# Altium project Audio_Jammer.PrjPcb
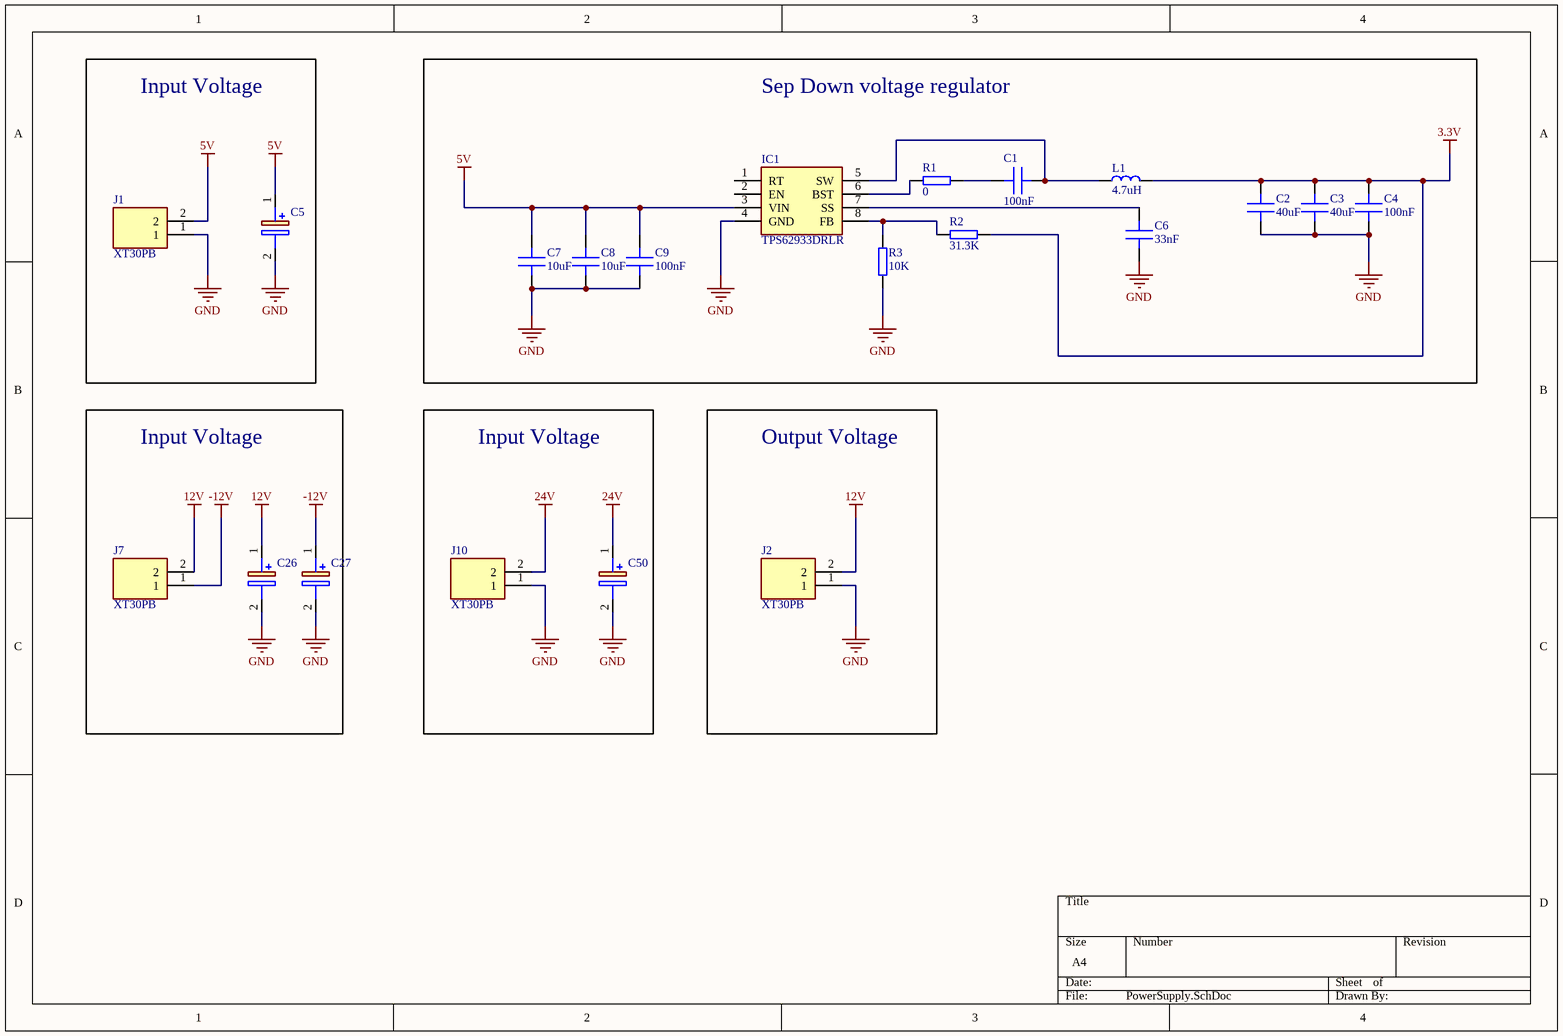
[diagram p0: PowerSupply.SchDoc]
4 sheets, 108 parts. Net scope: flat (ports and power ports of the same name join across sheets).
Board file: MainDevice.PcbDoc
Sheets:
  PowerSupply.SchDoc
  MCU.SchDoc
  Interface.SchDoc
  Amplifiers.SchDoc

## Sheet PowerSupply.SchDoc
size A4; SheetNumber: 1; SheetTotal: 4

### Parts
C1  100nF  [C 0402]
C2  40uF  [C 1206]
C3  40uF  [C 1206]
C4  100nF  [C 0603]
C5  UVY1V101MED1TD  [CAPPRD250W50D655H1250]  (value not drawn)
C6  33nF  [C 0402]
C7  10uF  [C 1206]
C8  10uF  [C 1206]
C9  100nF  [C 0603]
C26  UVY1V101MED1TD  [CAPPRD250W50D655H1250]  (value not drawn)
C27  UVY1V101MED1TD  [CAPPRD250W50D655H1250]  (value not drawn)
C50  UVY1V101MED1TD  [CAPPRD250W50D655H1250]  (value not drawn)
IC1  TPS62933DRLR  [SOTFL50P160X60-8N]
J1  XT30PB  [XT30PB]
J2  XT30PB  [XT30PB]
J7  XT30PB  [XT30PB]
J10  XT30PB  [XT30PB]
L1  4.7uH  [HPI0630]
R1  0  [R 0402]
R2  31.3K  [R 0402]
R3  10K  [R 0402]

### Blocks framed on the sheet
Input Voltage: C5 J1
Sep Down voltage regulator: C1-C4 C6-C9 IC1 L1 R1-R3
Input Voltage: C26 C27 J7
Input Voltage: C50 J10
Output Voltage: J2

### Nets
3.3V: C2.1 C3.1 C4.1 L1.2 R2.1
5V: C5.1(+) C7.1 C8.1 C9.1 IC1.3(VIN) J1.2
12V: C26.1(+) J2.2 J7.2
24V: C50.1(+) J10.2
-12V: C27.1(+) J7.1
GND: C2.2 C3.2 C4.2 C5.2(-) C6.2 C7.2 C8.2 C9.2 C26.2(-) C27.2(-) C50.2(-) IC1.4(GND) J1.1 J2.1 J10.1 R3.1
NetC1_1: C1.1 R1.1
NetC1_2: C1.2 IC1.5(SW) L1.1
NetC6_1: C6.1 IC1.7(SS)
NetIC1_6: IC1.6(BST) R1.2
NetIC1_8: IC1.8(FB) R2.2 R3.2

Not connected (* = marked no-connect by the designer): IC1 1(RT) 2(EN)

### Library data of the parts
C1-C4 C6-C9 = Capacitor: MLCC Capacitor
C5 C26 C27 C50 = UVY1V101MED1TD: Capacitor Polarised; Manufacturer_Name: Nichicon; Datasheet Link: http://nichicon-us.com/english/products/pdfs/e-uvy.pdf; Height: 12.5mm; Manufacturer_Part_Number: UVY1V101MED1TD; Arrow Part Number: UVY1V101MED1TD; Arrow Price/Stock: https://www.arrow.com/en/products/uvy1v101med1td/nichicon
IC1 = TPS62933DRLR: Integrated Circuit; Manufacturer_Name: Texas Instruments; Datasheet Link: https://www.ti.com/lit/ds/symlink/tps62933.pdf?ts=1626073394234; Height: 0.6mm; Manufacturer_Part_Number: TPS62933DRLR; Mouser Part Number: 595-TPS62933DRLR; Mouser Price/Stock: https://www.mouser.co.uk/ProductDetail/Texas-Instruments/TPS62933DRLR?qs=Rp5uXu7WBW9fv47wfQVntQ%3D%3D; Arrow Part Number: TPS62933DRLR; Arrow Price/Stock: https://www.arrow.com/en/products/tps62933drlr/texas-instruments?utm_currency=USD&region=nac
J1 J2 J7 J10 = XT30PB: Connector; Manufacturer_Name: Amass; Datasheet Link: https://www.tme.eu/Document/4acc913878197f8c2e30d4b8cdc47230/XT30UPB%20SPEC.pdf; Height: 10.7mm; Manufacturer_Part_Number: XT30PB
L1 = Inductor: General pourpouse inductor
R1-R3 = Resistor: General pourpouse resistor

## Sheet MCU.SchDoc
size A4; SheetNumber: 2; SheetTotal: 4
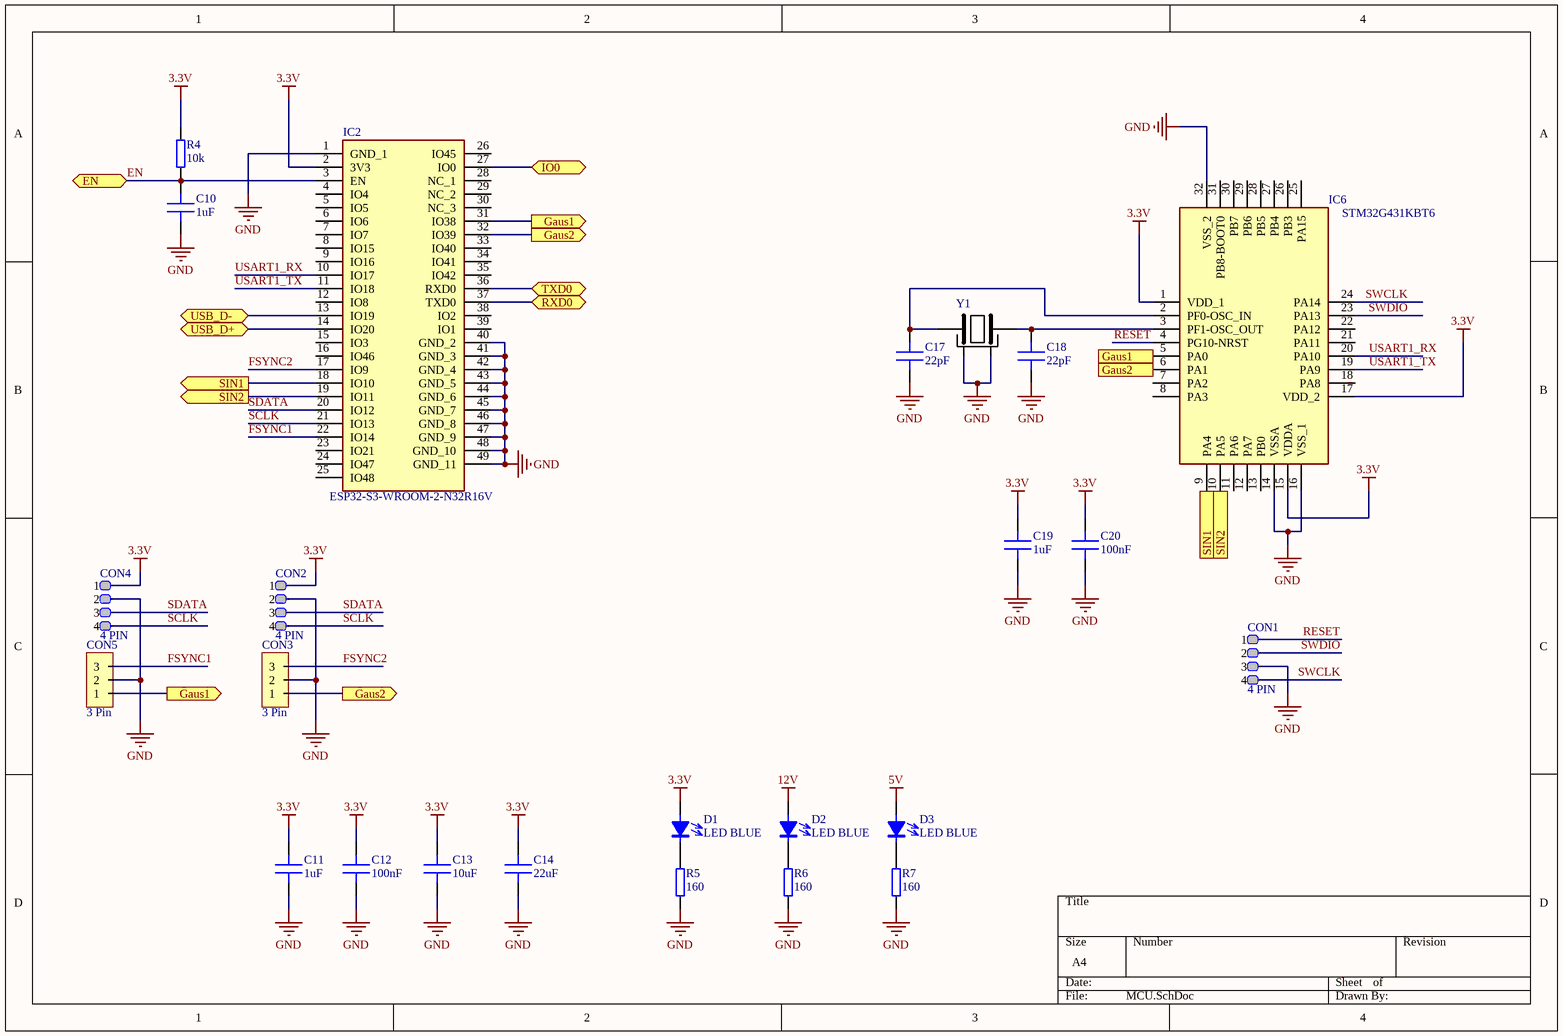
[diagram p1: MCU.SchDoc]

### Parts
C10  1uF  [C 0402]
C11  1uF  [C 0402]
C12  100nF  [C 0402]
C13  10uF  [C 0402]
C14  22uF  [C 0402]
C17  22pF  [C 0402]
C18  22pF  [C 0402]
C19  1uF  [C 0402]
C20  100nF  [C 0402]
CON1  4 PIN  [SM04B-SRSS-TB]
CON2  4 PIN  [Goldpin 2.54 4P]
CON3  3 Pin  [Goldpin 2.54 3P]
CON4  4 PIN  [Goldpin 2.54 4P]
CON5  3 Pin  [Goldpin 2.54 3P]
D1  LED BLUE  [LED 0603 BLUE]
D2  LED BLUE  [LED 0603 BLUE]
D3  LED BLUE  [LED 0603 BLUE]
IC2  ESP32-S3-WROOM-2-N32R16V  [ESP32S3WROOM2N32R16V]
IC6  STM32G431KBT6  [QFP80P900X900X160-32N]
R4  10k  [R 0402]
R5  160  [R 0402]
R6  160  [R 0402]
R7  160  [R 0402]
Y1  MCSJK-7U-16.00-12-30-80-B-30  [MCSJK7U1600123080B30]  (value not drawn)

### Ports
EN (bidir), Gaus1 (out), Gaus2 (out), IO0 (bidir), RXD0 (bidir), SIN1 (out), SIN2 (out), TXD0 (bidir), USB_D+ (bidir), USB_D- (bidir)

### Nets
3.3V: C11.1 C12.1 C13.1 C14.1 C19.1 C20.1 CON2.1 CON4.1 D1.1 IC2.2(3V3) IC6.1(VDD_1) IC6.15(VDDA) IC6.17(VDD_2) R4.2
5V: D3.1
12V: D2.1
GND: C10.2 C11.2 C12.2 C13.2 C14.2 C17.2 C18.2 C19.2 C20.2 CON1.3 CON2.2 CON3.2 CON4.2 CON5.2 IC2.1(GND_1) IC2.40(GND_2) IC2.41(GND_3) IC2.42(GND_4) IC2.43(GND_5) IC2.44(GND_6) IC2.45(GND_7) IC2.46(GND_8) IC2.47(GND_9) IC2.48(GND_10) IC2.49(GND_11) IC6.14(VSSA) IC6.16(VSS_1) IC6.32(VSS_2) R5.1 R6.1 R7.1 Y1.2(GND_1) Y1.4(GND_2)
EN: C10.1 IC2.3(EN) R4.1 ; port EN
FSYNC1: CON5.3 IC2.22(IO14)
FSYNC2: CON3.3 IC2.17(IO9)
IN1: IC2.18(IO10) IC6.9(PA4) ; port SIN1
IN2: IC2.19(IO11) IC6.10(PA5) ; port SIN2
IO0: IC2.27(IO0) ; port IO0
RESET: CON1.1 IC6.4(PG10-NRST)
RXD0: IC2.37(TXD0) ; port RXD0
SCLK: CON2.4 CON4.4 IC2.21(IO13)
SDATA: CON2.3 CON4.3 IC2.20(IO12)
SWCLK: CON1.4 IC6.24(PA14)
SWDIO: CON1.2 IC6.23(PA13)
TXD0: IC2.36(RXD0) ; port TXD0
USART1_RX: IC2.10(IO17) IC6.20(PA10)
USART1_TX: IC2.11(IO18) IC6.19(PA9)
NetC17_1: C17.1 IC6.2(PF0-OSC_IN) Y1.1(CRYSTAL_1)
NetC18_1: C18.1 IC6.3(PF1-OSC_OUT) Y1.3(CRYSTAL_2)
NetCON3_1: CON3.1 IC2.32(IO39) IC6.6(PA1) ; port Gaus2
NetCON5_1: CON5.1 IC2.31(IO38) IC6.5(PA0) ; port Gaus1
NetD1_2: D1.2 R5.2
NetD2_2: D2.2 R6.2
NetD3_2: D3.2 R7.2
NetD4_2: IC2.13(IO19) ; port USB_D-
NetD5_2: IC2.14(IO20) ; port USB_D+

Not connected (* = marked no-connect by the designer): IC2 4(IO4) 5(IO5) 6(IO6) 7(IO7) 8(IO15) 9(IO16) 12(IO8) 15(IO3) 16(IO46) 23(IO21) 24(IO47) 25(IO48) 26(IO45) 28(NC_1) 29(NC_2) 30(NC_3) 33(IO40) 34(IO41) 35(IO42) 38(IO2) 39(IO1); IC6 7(PA2) 8(PA3) 11(PA6) 12(PA7) 13(PB0) 18(PA8) 21(PA11) 22(PA12) 25(PA15) 26(PB3) 27(PB4) 28(PB5) 29(PB6) 30(PB7) 31(PB8-BOOT0)

### Library data of the parts
C10-C14 C17-C20 = Capacitor: MLCC Capacitor
IC2 = ESP32-S3-WROOM-2-N32R16V: Integrated Circuit; Manufacturer_Name: Espressif Systems; Datasheet Link: https://www.digikey.in/en/products/detail/espressif-systems/ESP32-S3-WROOM-2-N32R16V/25811280; Height: 3.25mm; Manufacturer_Part_Number: ESP32-S3-WROOM-2-N32R16V; Mouser Part Number: 356-SP32S3WM2N32R16V; Mouser Price/Stock: https://www.mouser.co.uk/ProductDetail/Espressif-Systems/ESP32-S3-WROOM-2-N32R16V?qs=%252BHhoWzUJg4Kf%2FwmS40wg%252BQ%3D%3D
IC6 = STM32G431KBT6: Integrated Circuit; Manufacturer_Name: STMicroelectronics; Datasheet Link: https://www.st.com/resource/en/datasheet/stm32g431kb.pdf; Height: 1.6mm; Manufacturer_Part_Number: STM32G431KBT6; Mouser Part Number: 511-STM32G431KBT6; Mouser Price/Stock: https://www.mouser.co.uk/ProductDetail/STMicroelectronics/STM32G431KBT6?qs=T3oQrply3y8teCTeNAFOLg%3D%3D; Arrow Part Number: STM32G431KBT6; Arrow Price/Stock: https://www.arrow.com/en/products/stm32g431kbt6/stmicroelectronics
R4-R7 = Resistor: General pourpouse resistor
Y1 = MCSJK-7U-16.00-12-30-80-B-30: Crystal or Oscillator; Manufacturer_Name: MULTICOMP; Datasheet Link: https://www.farnell.com/datasheets/2864166.pdf; Height: 0.8mm; Manufacturer_Part_Number: MCSJK-7U-16.00-12-30-80-B-30

## Sheet Interface.SchDoc
size A4; SheetNumber: 3; SheetTotal: 4
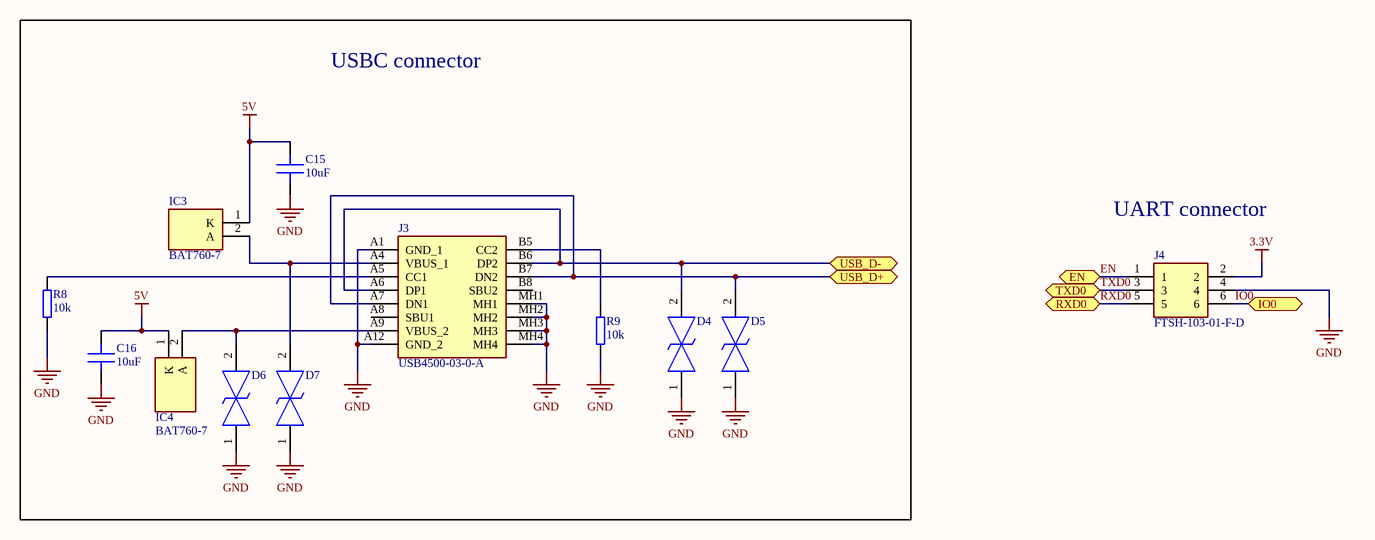
[diagram p2: Interface.SchDoc]

### Parts
C15  10uF  [C 0402]
C16  10uF  [C 0402]
D4  LESD5D5.0CT1G  [LESD5D50CT1G]  (value not drawn)
D5  LESD5D5.0CT1G  [LESD5D50CT1G]  (value not drawn)
D6  LESD5D5.0CT1G  [LESD5D50CT1G]  (value not drawn)
D7  LESD5D5.0CT1G  [LESD5D50CT1G]  (value not drawn)
IC3  BAT760-7  [SOD2513X120N]
IC4  BAT760-7  [SOD2513X120N]
J3  USB4500-03-0-A  [USB4500030A]
J4  FTSH-103-01-F-D  [FTSH-103-XX-YYY-D]
R8  10k  [R 0402]
R9  10k  [R 0402]

### Blocks framed on the sheet
USBC connector: C15 C16 D4-D7 IC3 IC4 J3 R8 R9

### Ports
EN (bidir), IO0 (bidir), RXD0 (bidir), TXD0 (bidir), USB_D+ (bidir), USB_D- (bidir)

### Nets
3.3V: J4.2
5V: C15.1 C16.1 IC3.1(K) IC4.1(K)
GND: C15.2 C16.2 D4.1 D5.1 D6.1 D7.1 J3.A1(GND_1) J3.A12(GND_2) J3.MH1 J3.MH2 J3.MH3 J3.MH4 J4.4 R8.1 R9.1
EN: J4.1 ; port EN
IO0: J4.6 ; port IO0
RXD0: J4.5 ; port RXD0
TXD0: J4.3 ; port TXD0
NetD4_2: D4.2 J3.A6(DP1) J3.B6(DP2) ; port USB_D-
NetD5_2: D5.2 J3.A7(DN1) J3.B7(DN2) ; port USB_D+
NetD6_2: D6.2 IC4.2(A) J3.A9(VBUS_2)
NetD7_2: D7.2 IC3.2(A) J3.A4(VBUS_1)
NetJ3_A5: J3.A5(CC1) R8.2
NetJ3_B5: J3.B5(CC2) R9.2

Not connected (* = marked no-connect by the designer): J3 A8(SBU1) B8(SBU2)

### Notes on the sheet
- UART connector

### Library data of the parts
C15 C16 = Capacitor: MLCC Capacitor
D4-D7 = LESD5D5.0CT1G: TVS Diode (Bi-directional); Manufacturer_Name: LRC; Height: 0.7mm; Manufacturer_Part_Number: LESD5D5.0CT1G
IC3 IC4 = BAT760-7: Integrated Circuit; Manufacturer_Name: Lattice Semiconductor; Datasheet Link: https://www.diodes.com/assets/Datasheets/ds30498.pdf; Height: 1.2mm; Manufacturer_Part_Number: BAT760-7; Mouser Part Number: N/A; Mouser Price/Stock: https://www.mouser.com/Search/Refine.aspx?Keyword=N%2FA
J3 = USB4500-03-0-A: Connector; Manufacturer_Name: GCT (GLOBAL CONNECTOR TECHNOLOGY); Datasheet Link: https://componentsearchengine.com/Datasheets/2/USB4500-03-0-A.pdf; Manufacturer_Part_Number: USB4500-03-0-A; Mouser Part Number: 640-USB4500030A; Mouser Price/Stock: https://www.mouser.co.uk/ProductDetail/GCT/USB4500-03-0-A?qs=7D1LtPJG0i2mVyw7UtV%2FkQ%3D%3D
J4 = FTSH-103-01-F-D: Connector; Manufacturer_Name: SAMTEC; Datasheet Link: http://suddendocs.samtec.com/prints/ftsh-1xx-xx-xxx-d-xxx-xx-mkt.pdf; Manufacturer_Part_Number: FTSH-103-01-F-D; Mouser Part Number: 200-FTSH10301FD; Mouser Price/Stock: https://www.mouser.co.uk/ProductDetail/Samtec/FTSH-103-01-F-D?qs=0lQeLiL1qyb7OHmlWV4egA%3D%3D; Arrow Part Number: FTSH-103-01-F-D; Arrow Price/Stock: https://www.arrow.com/en/products/ftsh-103-01-f-d/samtec
R8 R9 = Resistor: General pourpouse resistor

## Sheet Amplifiers.SchDoc
size A4; SheetNumber: 4; SheetTotal: 4
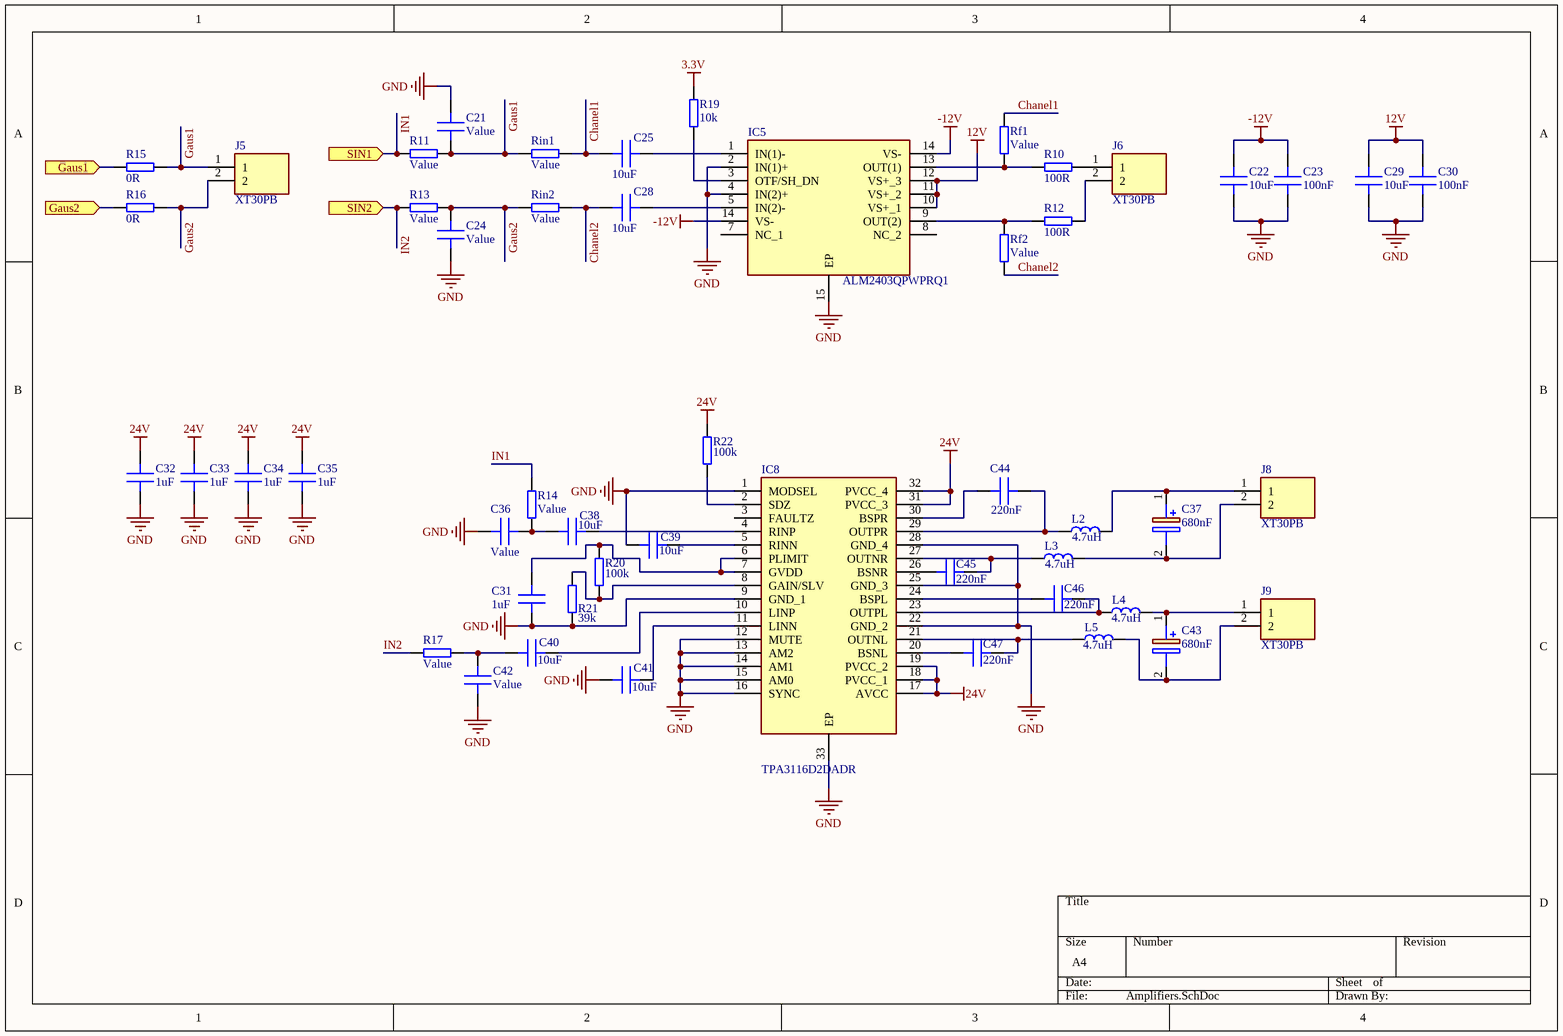
[diagram p3: Amplifiers.SchDoc]

### Parts
C21  Value  [C 0402]
C22  10uF  [C 0805]
C23  100nF  [C 0805]
C24  Value  [C 0402]
C25  10uF  [C 0805]
C28  10uF  [C 0805]
C29  10uF  [C 0805]
C30  100nF  [C 0805]
C31  1uF  [C 0402]
C32  1uF  [C 0603]
C33  1uF  [C 0603]
C34  1uF  [C 0603]
C35  1uF  [C 0603]
C36  Value  [C 0402]
C37  680nF  [CAPPRD250W50D655H1250]
C38  10uF  [C 0805]
C39  10uF  [C 0402]
C40  10uF  [C 0805]
C41  10uF  [C 0402]
C42  Value  [C 0402]
C43  680nF  [CAPPRD250W50D655H1250]
C44  220nF  [C 0402]
C45  220nF  [C 0402]
C46  220nF  [C 0402]
C47  220nF  [C 0402]
IC5  ALM2403QPWPRQ1  [SOP65P640X120-15N]
IC8  TPA3116D2DADR  [SOP65P810X120-33N]
J5  XT30PB  [XT30PB]
J6  XT30PB  [XT30PB]
J8  XT30PB  [XT30PB]
J9  XT30PB  [XT30PB]
L2  4.7uH  [HPI0630]
L3  4.7uH  [HPI0630]
L4  4.7uH  [HPI0630]
L5  4.7uH  [HPI0630]
R10  100R  [R 1206]
R11  Value  [R 0402]
R12  100R  [R 1206]
R13  Value  [R 0402]
R14  Value  [R 0402]
R15  0R  [R 0402]
R16  0R  [R 0402]
R17  Value  [R 0402]
R19  10k  [R 0402]
R20  100k  [R 0402]
R21  39k  [R 0402]
R22  100k  [R 0402]
Rf1  Value  [R 0402]
Rf2  Value  [R 0402]
Rin1  Value  [R 0402]
Rin2  Value  [R 0402]

### Ports
Gaus1 (in), Gaus2 (in), SIN1 (in), SIN2 (in)

### Nets
3.3V: R19.1
12V: C29.1 C30.1 IC5.10(VS+_1) IC5.11(VS+_2) IC5.12(VS+_3)
24V: C32.1 C33.1 C34.1 C35.1 IC8.17(AVCC) IC8.18(PVCC_1) IC8.19(PVCC_2) IC8.31(PVCC_3) IC8.32(PVCC_4) R22.2
-12V: C22.1 C23.1 IC5.14(VS-)
GND: C21.1 C22.2 C23.2 C24.2 C29.2 C30.2 C31.1 C32.2 C33.2 C34.2 C35.2 C36.1 C39.1 C41.1 C42.1 IC5.2(IN(1)+) IC5.4(IN(2)+) IC5.15(EP) IC8.1(MODSEL) IC8.9(GND_1) IC8.12(MUTE) IC8.13(AM2) IC8.14(AM1) IC8.15(AM0) IC8.16(SYNC) IC8.22(GND_2) IC8.25(GND_3) IC8.28(GND_4) IC8.33(EP) R21.1
Chanel1: C25.1 Rf1.2 Rin1.2
Chanel2: C28.1 Rf2.2 Rin2.2
Gaus1: C21.2 J5.1 R11.2 R15.2 Rin1.1
Gaus2: C24.1 J5.2 R13.2 R16.2 Rin2.1
IN1: R11.1 R14.1 ; port SIN1
IN2: R13.1 R17.2 ; port SIN2
NetC25_2: C25.2 IC5.1(IN(1)-)
NetC28_2: C28.2 IC5.5(IN(2)-)
NetC31_2: C31.2 IC8.6(PLIMIT) IC8.7(GVDD) R20.2
NetC36_2: C36.2 C38.1 R14.2
NetC37_1: C37.1(+) J8.1 L2.2
NetC37_2: C37.2(-) J8.2 L3.2
NetC38_2: C38.2 IC8.4(RINP)
NetC39_2: C39.2 IC8.5(RINN)
NetC40_1: C40.1 C42.2 R17.1
NetC40_2: C40.2 IC8.10(LINP)
NetC41_2: C41.2 IC8.11(LINN)
NetC43_1: C43.1(+) J9.1 L4.2
NetC43_2: C43.2(-) J9.2 L5.2
NetC44_1: C44.1 IC8.30(BSPR)
NetC44_2: C44.2 IC8.29(OUTPR) L2.1
NetC45_1: C45.1 IC8.26(BSNR)
NetC45_2: C45.2 IC8.27(OUTNR) L3.1
NetC46_1: C46.1 IC8.24(BSPL)
NetC46_2: C46.2 IC8.23(OUTPL) L4.1
NetC47_1: C47.1 IC8.20(BSNL)
NetC47_2: C47.2 IC8.21(OUTNL) L5.1
NetCON3_1: R16.1 ; port Gaus2
NetCON5_1: R15.1 ; port Gaus1
NetIC5_3: IC5.3(OTF/SH_DN) R19.2
NetIC5_9: IC5.9(OUT(2)) R12.2 Rf2.1
NetIC5_13: IC5.13(OUT(1)) R10.2 Rf1.1
NetIC8_2: IC8.2(SDZ) R22.1
NetIC8_8: IC8.8(GAIN/SLV) R20.1 R21.2
NetJ6_1: J6.1 R10.1
NetJ6_2: J6.2 R12.1

Not connected (* = marked no-connect by the designer): IC5 7(NC_1) 8(NC_2); IC8 3(FAULTZ)

### Library data of the parts
C21-C25 C28-C36 C38-C42 C44-C47 = Capacitor: MLCC Capacitor
C37 C43 = UVY1V101MED1TD: as C5 on sheet PowerSupply; Datasheet Link: http://nichicon-us.com/english/products/pdfs/e-uvy.pdf; Height: 12.5mm; Manufacturer_Part_Number: UVY1V101MED1TD; Arrow Part Number: UVY1V101MED1TD; Arrow Price/Stock: https://www.arrow.com/en/products/uvy1v101med1td/nichicon
IC5 = ALM2403QPWPRQ1: Integrated Circuit; Manufacturer_Name: Texas Instruments; Datasheet Link: https://www.ti.com/lit/ds/symlink/alm2403-q1.pdf?ts=1609171403376&ref_url=https%253A%252F%252Fwww.mouser.de%252F; Height: 1.2mm; Manufacturer_Part_Number: ALM2403QPWPRQ1; Mouser Part Number: 595-ALM2403QPWPRQ1; Mouser Price/Stock: https://www.mouser.co.uk/ProductDetail/Texas-Instruments/ALM2403QPWPRQ1?qs=KUoIvG%2F9IlbGB6vKF5Gy0A%3D%3D; Arrow Part Number: ALM2403QPWPRQ1; Arrow Price/Stock: https://www.arrow.com/en/products/alm2403qpwprq1/texas-instruments?region=nac
IC8 = TPA3116D2DADR: Integrated Circuit; Manufacturer_Name: Texas Instruments; Datasheet Link: http://www.ti.com/lit/gpn/tpa3116d2; Height: 1.2mm; Manufacturer_Part_Number: TPA3116D2DADR; Mouser Part Number: 595-TPA3116D2DADR; Mouser Price/Stock: https://www.mouser.co.uk/ProductDetail/Texas-Instruments/TPA3116D2DADR?qs=3AcK5DacLbpIP1YDOj0hAg%3D%3D; Arrow Part Number: TPA3116D2DADR; Arrow Price/Stock: https://www.arrow.com/en/products/tpa3116d2dadr/texas-instruments?utm_currency=USD&region=nac
J5 J6 J8 J9 = XT30PB: Connector; Manufacturer_Name: Amass; Datasheet Link: https://www.tme.eu/Document/4acc913878197f8c2e30d4b8cdc47230/XT30UPB%20SPEC.pdf; Height: 10.7mm; Manufacturer_Part_Number: XT30PB
L2-L5 = Inductor: General pourpouse inductor
R10-R17 R19-R22 Rf1 Rf2 Rin1 Rin2 = Resistor: General pourpouse resistor

## Nets that join several sheets
3.3V: PowerSupply (5 pins), MCU (14 pins), Interface (J4.2), Amplifiers (R19.1)
5V: PowerSupply (6 pins), MCU (D3.1), Interface (C15.1 C16.1 IC3.1 IC4.1)
12V: PowerSupply (C26.1 J2.2 J7.2), MCU (D2.1), Amplifiers (5 pins)
24V: PowerSupply (C50.1 J10.2), Amplifiers (10 pins)
-12V: PowerSupply (C27.1 J7.1), Amplifiers (C22.1 C23.1 IC5.14)
GND: PowerSupply (16 pins), MCU (33 pins), Interface (15 pins), Amplifiers (30 pins)
EN: MCU (C10.1 IC2.3 R4.1), Interface (J4.1)
IN1: MCU (IC2.18 IC6.9), Amplifiers (R11.1 R14.1)
IN2: MCU (IC2.19 IC6.10), Amplifiers (R13.1 R17.2)
IO0: MCU (IC2.27), Interface (J4.6)
NetCON3_1: MCU (CON3.1 IC2.32 IC6.6), Amplifiers (R16.1)
NetCON5_1: MCU (CON5.1 IC2.31 IC6.5), Amplifiers (R15.1)
NetD4_2: MCU (IC2.13), Interface (D4.2 J3.A6 J3.B6)
NetD5_2: MCU (IC2.14), Interface (D5.2 J3.A7 J3.B7)
RXD0: MCU (IC2.37), Interface (J4.5)
TXD0: MCU (IC2.36), Interface (J4.3)